# EAGLE design FinalChannel (EAGLE 8.0.0)
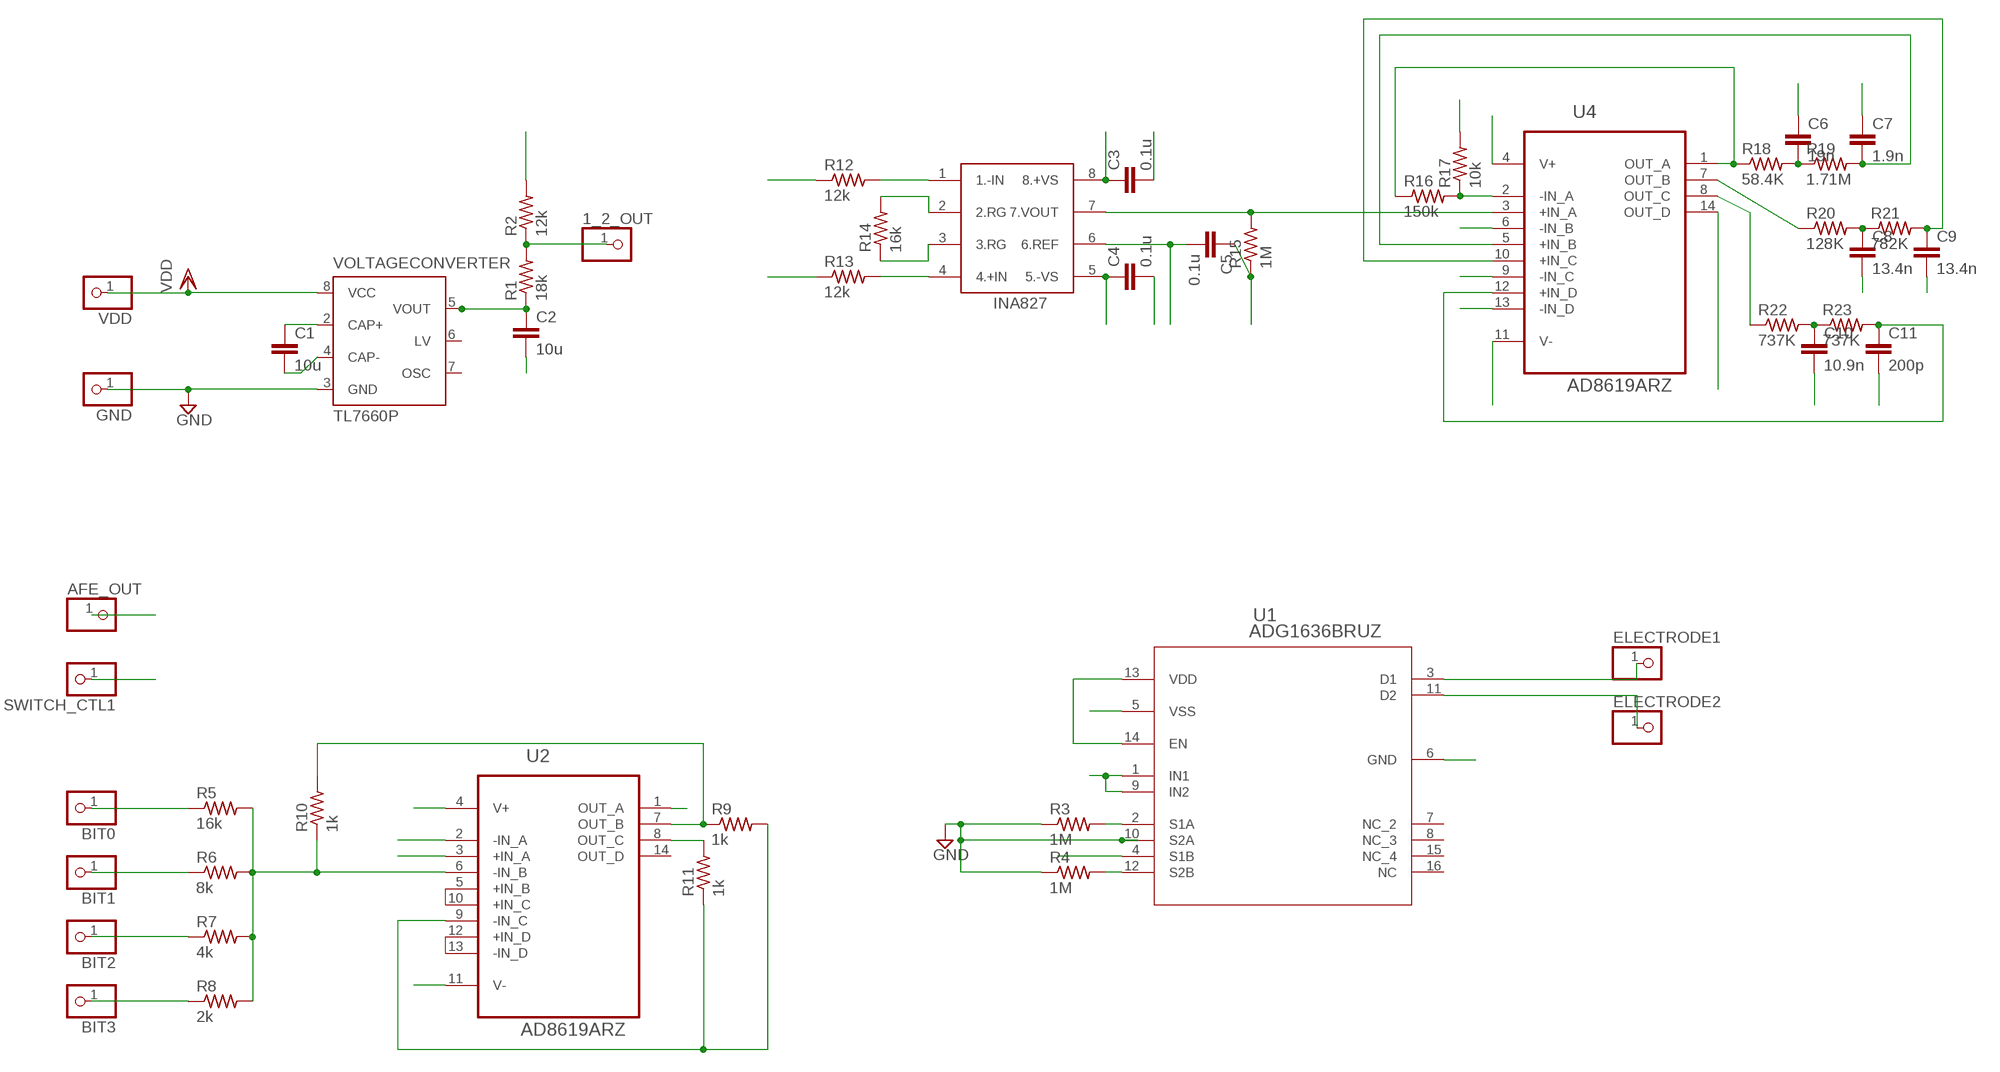
[diagram p0: schematic, sheet 1]

## Parts
1_2_OUT  PINHD-1X1  [1X01]
AFE_OUT  PINHD-1X1  [1X01]
BIT0  PINHD-1X1  [1X01]
BIT1  PINHD-1X1  [1X01]
BIT2  PINHD-1X1  [1X01]
BIT3  PINHD-1X1  [1X01]
C1  10u  C-EUC0805  [C0805]
C2  10u  C-EUC0805  [C0805]
C3  0.1u  C-EUC0805  [C0805]
C4  0.1u  C-EUC0805  [C0805]
C5  0.1u  C-EUC0805  [C0805]
C6  19n  C-EUC0805  [C0805]
C7  1.9n  C-EUC0805  [C0805]
C8  13.4n  C-EUC0805  [C0805]
C9  13.4n  C-EUC0805  [C0805]
C10  10.9n  C-EUC0805  [C0805]
C11  200p  C-EUC0805  [C0805]
ELECTRODE1  PINHD-1X1  [1X01]
ELECTRODE2  PINHD-1X1  [1X01]
GND  PINHD-1X1  [1X01]
INA1  INA827  [INA827]
R1  18k  R-US_R0805  [R0805]
R2  12k  R-US_R0805  [R0805]
R3  1M  R-US_M0805  [M0805]
R4  1M  R-US_M0805  [M0805]
R5  16k  R-US_M0805  [M0805]
R6  8k  R-US_M0805  [M0805]
R7  4k  R-US_M0805  [M0805]
R8  2k  R-US_M0805  [M0805]
R9  1k  R-US_M0805  [M0805]
R10  1k  R-US_M0805  [M0805]
R11  1k  R-US_M0805  [M0805]
R12  12k  R-US_M0805  [M0805]
R13  12k  R-US_M0805  [M0805]
R14  16k  R-US_M0805  [M0805]
R15  1M  R-US_M0805  [M0805]
R16  150k  R-US_M0805  [M0805]
R17  10k  R-US_M0805  [M0805]
R18  58.4K  R-US_M0805  [M0805]
R19  1.71M  R-US_M0805  [M0805]
R20  128K  R-US_M0805  [M0805]
R21  782K  R-US_M0805  [M0805]
R22  737K  R-US_M0805  [M0805]
R23  737K  R-US_M0805  [M0805]
SWITCH_CTL1  PINHD-1X1  [1X01]
U1  ADG1636BRUZ  [RU_16]
U2  AD8619ARZ  [SOIC127P600X175-14N]
U4  AD8619ARZ  [SOIC127P600X175-14N]
VDD  PINHD-1X1  [1X01]
VOLTAGECONVERTER  TL7660P  [DIL08]

## Nets
1_2_OUT: 1_2_OUT.1 R1.2 R2.1
AFE_OUT: AFE_OUT.1 C10.2 U4.13(-IN_D) U4.14(OUT_D)
CTL1: SWITCH_CTL1.1 U1.1(IN1) U1.9(IN2)
E_1: ELECTRODE1.1 U1.3(D1)
E_2: ELECTRODE2.1 U1.11(D2)
GND: C2.2 C3.2 C4.2 C7.1 C9.2 C11.2 GND.1 R2.2 R3.1 R4.1 R17.2 U1.6(GND) U1.10(S2A) U2.3(+IN_A) U2.5(+IN_B) U2.10(+IN_C) U2.12(+IN_D) U2.13(-IN_D) VOLTAGECONVERTER.3(GND)
IN_N: R4.2 R12.1 U1.12(S2B)
IN_P: R3.2 R13.1 U1.2(S1A)
N$1: C1.1 VOLTAGECONVERTER.2(CAP+)
N$2: C1.2 VOLTAGECONVERTER.4(CAP-)
N$3: R9.2 R11.1 U2.9(-IN_C)
N$4: INA1.1(1.-IN) R12.2
N$5: INA1.4(4.+IN) R13.2
N$6: BIT0.1 R5.1
N$7: BIT1.1 R6.1
N$10: BIT2.1 R7.1
N$11: BIT3.1 R8.1
N$12: R5.2 R6.2 R7.2 R8.2 R10.1 U2.6(-IN_B)
N$13: R9.1 R10.2 U2.7(OUT_B)
N$14: INA1.2(2.RG) R14.2
N$15: INA1.3(3.RG) R14.1
N$17: INA1.7(7.VOUT) R15.2 U4.3(+IN_A)
N$19: R16.2 R17.1 U4.2(-IN_A)
N$20: R16.1 R18.1 U4.1(OUT_A)
N$21: C6.2 R18.2 R19.1
N$22: C7.2 R19.2 U4.5(+IN_B)
N$23: C8.1 R20.2 R21.1
N$24: C9.1 R21.2 U4.10(+IN_C)
N$25: C10.1 R22.2 R23.1
N$26: C11.1 R23.2 U4.12(+IN_D)
OUT_B: C6.1 R20.1 U4.6(-IN_B) U4.7(OUT_B)
OUT_C: C8.2 R22.1 U4.8(OUT_C) U4.9(-IN_C)
P_GEN_OUT: R11.2 U1.4(S1B) U2.8(OUT_C)
SINGLE-: C5.1 R15.1 U2.2(-IN_A)
SINGLE_OUT: C5.2 INA1.6(6.REF) U2.1(OUT_A)
VDD: C3.1 INA1.8(8.+VS) U1.13(VDD) U1.14(EN) U2.4(V+) U4.4(V+) VDD.1 VOLTAGECONVERTER.8(VCC)
VDD-: C2.1 C4.1 INA1.5(5.-VS) R1.1 U1.5(VSS) U2.11(V-) U4.11(V-) VOLTAGECONVERTER.5(VOUT)
Unconnected: U1.7(NC_2) U1.8(NC_3) U1.15(NC_4) U1.16(NC) U2.14(OUT_D) VOLTAGECONVERTER.6(LV) VOLTAGECONVERTER.7(OSC)

## Library data of the parts
1_2_OUT AFE_OUT BIT0 BIT1-BIT3 ELECTRODE1 ELECTRODE2 GND SWITCH_CTL1 VDD = pinhead:PINHD-1X1: PIN HEADER
C1-C11 = rcl:C-EU: CAPACITOR, European symbol
INA1 = INA827:INA827
R1-R23 = rcl:R-US_: RESISTOR, American symbol
U1 = ADParts:ADG1636BRUZ
U2 U4 = AD8619ARZ:AD8619ARZ: Operational Amplifiers; AVAILABILITY: Good; DESCRIPTION: OP Amp Quad GP R-R I/O ???}2.5V/5V 14-Pin SOIC N Tube; MF: Analog Devices; MP: AD8619ARZ; PACKAGE: SOIC-14 Analog Devices; PRICE: 1.96 USD
VOLTAGECONVERTER = texas:TL7660: CMOS VOLTAGE CONVERTER Source: http://focus.ti.com/lit/ds/scas794/scas794.pdf; MPN: TL7660CP; OC_FARNELL: 1755283; OC_NEWARK: 14M2447

## Board
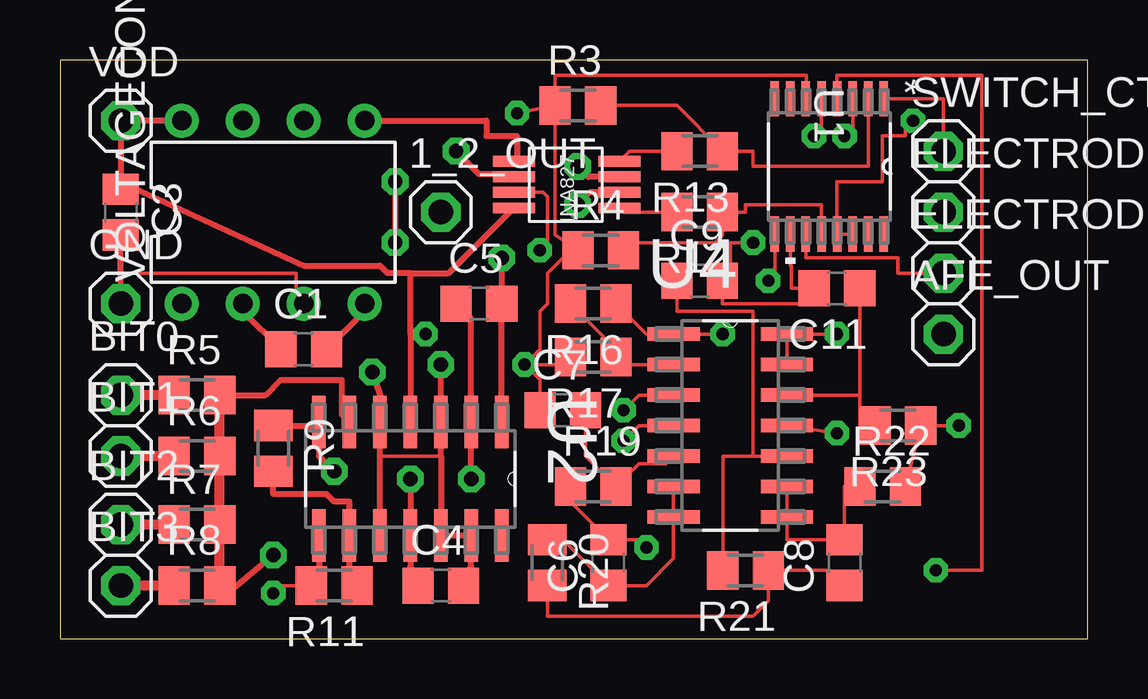
[diagram p1: board, top side]
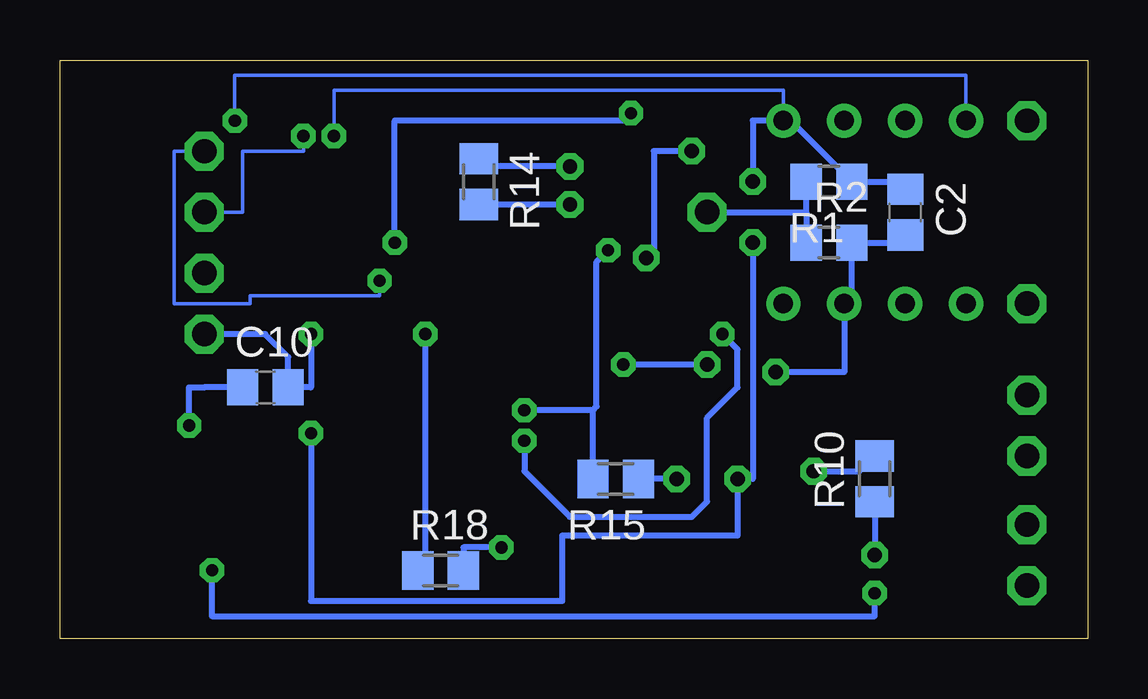
[diagram p2: board, bottom side, seen from below]

Size 42.85 x 24.12 mm. Coordinates in mm from the lower left corner, seen from the top.
Outline: 0,0 42.85,0 42.85,24.12 0,24.12 0,0
Copper layers (1*16): Top 0.035mm / dielectric 1.5mm / Bottom 0.035mm
Design rules "AdvancedCircuitsBarebones": minimum track width 6mil, minimum drill 20mil, track to track 6mil, track to pad 6mil, pad to pad 6mil, via to via 6mil, smd to smd 6mil, copper to edge 10mil, drill to drill 6mil, minimum pad ring 12mil, minimum via ring 10mil, stop-mask expansion 4mil, vias tented up to drill 25mil, thermal gap 10mil

### Footprints (pad centres in the part's own frame; a part is rotated, then mirrored left to right if it is on the bottom)
1X01 = drill 1.016 octagon: 1 0,0
C0805 = smd 1.3 x 1.5: 1 -0.95,0; 2 0.95,0
INA827 = smd 1.75 x 0.45: 1 -3,3; 2 -3,2.35; 3 -3,1.7; 4 -3,1.05; 5 1.4,1.05; 6 1.4,1.7; 7 1.4,2.35; 8 1.4,3
R0805 = smd 1.3 x 1.5: 1 -0.95,0; 2 0.95,0
M0805 = smd 1.3 x 1.6: 1 -0.95,0; 2 0.95,0
RU_16 = smd 1.473 x 0.356: 1 -2.819,2.275; 2 -2.819,1.625; 3 -2.819,0.975; 4 -2.819,0.325; 5 -2.819,-0.325; 6 -2.819,-0.975; 7 -2.819,-1.625; 8 -2.819,-2.275; 9 2.819,-2.275; 10 2.819,-1.625; 11 2.819,-0.975; 12 2.819,-0.325; 13 2.819,0.325; 14 2.819,0.975; 15 2.819,1.625; 16 2.819,2.275
SOIC127P600X175-14N = smd 2.184 x 0.559: 1 -2.362,3.81; 2 -2.362,2.54; 3 -2.362,1.27; 4 -2.362,0; 5 -2.362,-1.27; 6 -2.362,-2.54; 7 -2.362,-3.81; 8 2.362,-3.81; 9 2.362,-2.54; 10 2.362,-1.27; 11 2.362,0; 12 2.362,1.27; 13 2.362,2.54; 14 2.362,3.81
DIL08 = drill 0.813 pad 1.27: 1 -3.81,-3.81; 2 -1.27,-3.81; 3 1.27,-3.81; 4 3.81,-3.81; 5 3.81,3.81; 6 1.27,3.81; 7 -1.27,3.81; 8 -3.81,3.81

### Placement (x,y rotation side)
1_2_OUT  15.88,17.78 0 top
AFE_OUT  36.83,12.7 0 top
BIT0  2.54,10.16 0 top
BIT1  2.54,7.62 0 top
BIT2  2.54,4.76 0 top
BIT3  2.54,2.22 0 top
C1  10.16,12.06 0 top
C2  7.62,17.78 270 bottom
C3  2.54,17.78 270 top
C4  15.88,2.22 0 top
C5  17.46,13.97 0 top
C6  22.86,3.17 90 top
C7  20.95,9.52 0 top
C8  32.7,3.17 90 top
C9  26.67,14.92 0 top
C10  34.29,10.48 0 bottom
C11  32.38,14.6 180 top
ELECTRODE1  36.83,17.78 0 top
ELECTRODE2  36.83,15.24 0 top
GND  2.54,13.97 0 top
INA1  20.32,20.95 180 top
R1  10.79,19.05 180 bottom
R2  10.79,16.51 0 bottom
R3  21.59,22.23 0 top
R4  22.54,16.19 0 top
R5  5.71,10.16 0 top
R6  5.71,7.62 0 top
R7  5.71,4.76 0 top
R8  5.71,2.22 0 top
R9  8.89,7.94 270 top
R10  8.89,6.67 90 bottom
R11  11.43,2.22 180 top
R12  26.67,17.78 180 top
R13  26.67,20.32 180 top
R14  25.4,19.05 270 bottom
R15  19.68,6.67 180 bottom
R16  22.23,13.97 180 top
R17  22.23,11.75 180 top
R18  26.99,2.86 0 bottom
R19  22.23,6.35 0 top
R20  20.32,3.17 270 top
R21  28.57,2.86 180 top
R22  34.29,6.35 0 top
R23  34.92,8.89 180 top
SWITCH_CTL1  36.83,20.32 0 top
U1  32.07,19.68 270 top
U2  14.61,6.67 270 top
U4  27.94,8.89 0 top
VDD  2.54,21.59 0 top
VOLTAGECONVERTER  8.89,17.78 0 top

### Tracks (layer width: path | path; a pad name or v marks a point on that pad's centre or on a via)
1_2_OUT
  Bottom 0.254: 11.74,17.78 R1.2 | 11.74,17.78 R2.1 | 1_2_OUT.1 11.74,17.78
AFE_OUT  (via drill 0.51)
  Top 0.152: U4.13 U4.14 v32.38,12.7
  Bottom 0.254: v32.38,12.7 32.38,10.48 C10.2 33.34,11.75 34.29,12.7 AFE_OUT.1
CTL1  (via drill 0.51)
  Top 0.152: U1.1 36.83,22.5 SWITCH_CTL1.1 | U1.9 29.79,14.92 v29.53,14.92
  Bottom 0.152: v29.53,14.92 29.53,14.29 34.92,14.29 34.92,13.97 38.1,13.97 38.1,20.32 SWITCH_CTL1.1
E_1  (via drill 0.51)
  Top 0.152: U1.3 33.04,20.95 v32.7,20.95
  Bottom 0.152: v32.7,20.95 32.7,20.32 35.24,20.32 35.24,17.78 ELECTRODE1.1
E_2
  Top 0.152: U1.11 31.09,16.51 | 31.09,16.51 31.09,15.87 | 31.09,15.87 31.11,15.87 | 31.09,16.51 31.09,15.87 | ELECTRODE2.1 34.92,15.24 34.92,15.87 31.09,15.87
GND  (via drill 0.51, 0.6)
  Top 0.152: R3.1 20.64,21.59 20.64,21.27 20.64,16.83 R4.1 21.27,16.19 20.32,15.24 20.32,13.97 20,13.65 20,12.06 v19.37,11.43 | v19.37,11.43 20.96,11.43 R17.2 | 30.44,16.16 U1.10 | R3.1 20.64,23.49 31.11,23.49 31.11,22.53 U1.6 | 30.48,16.9 U1.10 | C7.1 20,10.79 v19.37,11.43 | v28.89,16.51 27.94,16.51 27.94,14.92 C9.2 27.62,13.97 31.11,13.97 31.11,14.6 C11.2 30.48,14.6 30.48,15.56 30.44,15.56 U1.10 | v19.05,21.91 R3.1 | U2.5 13.34,7.62 15.88,7.62 | C3.2 2.54,15.24 9.85,15.24 9.85,13.97 VOLTAGECONVERTER.3
  Top 0.254: U2.10 U2.5 13.34,10.16 v13.02,11.11 | GND.1 C3.2 | C4.2 17.14,3.03 U2.13 U2.12 15.88,7.62 U2.3 v15.88,11.43
  Bottom 0.254: C2.2 7.94,16.51 R2.2 9.85,14.29 VOLTAGECONVERTER.3 10.16,11.11 v13.02,11.11 | v28.89,16.51 28.89,21.59 19.05,21.59 v19.05,21.91 | v15.88,11.43 v19.37,11.43
IN_N
  Top 0.152: R4.2 23.81,16.51 27.3,16.51 27.62,16.82 R12.1 28.57,17.78 28.57,18.1 31.74,18.1 | 31.74,18.1 31.74,17.78 | 31.74,17.78 U1.12 | 31.74,17.78 31.74,18.1
IN_P
  Top 0.152: R3.2 25.71,22.23 R13.1 28.89,20.32 28.89,19.68 33.69,19.68 U1.2
  Top 0.254: R3.2 22.54,21.59 22.86,21.59
N$1
  Top 0.254: VOLTAGECONVERTER.2 7.62,13.65 C1.1
N$2
  Top 0.254: VOLTAGECONVERTER.4 12.7,13.65 C1.2
N$3
  Top 0.254: R11.1 12.06,2.22 U2.9 12.06,5.71 11.43,5.71 11.11,6.03 8.89,6.03 R9.2
N$4
  Top 0.152: R12.2 23.5,17.78 INA1.1
N$5
  Top 0.152: R13.2 23.73,20.32 INA1.4
N$6
  Top 0.406: R5.1 BIT0.1
N$7
  Top 0.406: R6.1 BIT1.1
N$10
  Top 0.406: R7.1 BIT2.1
N$11
  Top 0.406: R8.1 BIT3.1
N$12  (via drill 0.6)
  Top 0.254: R5.2 8.57,10.16 9.21,10.79 11.75,10.79 11.75,9.35 U2.6 | v8.89,3.49 6.98,1.9 R8.2
  Top 0.406: R5.2 R6.2 R7.2 R8.2
  Bottom 0.254: R10.1 v8.89,3.49
N$13  (via drill 0.6)
  Top 0.254: R9.1 10.65,8.89 U2.7 10.79,7.62 v11.43,6.98
  Bottom 0.254: v11.43,6.98 9.52,6.98 R10.2
N$14  (via drill 0.6)
  Top 0.254: INA1.2 22.1,18.6 v21.59,18.1
  Bottom 0.254: v21.59,18.1 R14.2
N$15  (via drill 0.6)
  Top 0.254: INA1.3 22.02,19.26 v21.59,19.68
  Bottom 0.254: v21.59,19.68 25.09,19.68 R14.1
N$17  (via drill 0.51)
  Top 0.152: INA1.7 20.13,18.6 20.32,18.41 20.32,16.51 v20,16.19 | U4.3 24.13,10.16 v23.5,9.52
  Bottom 0.254: R15.2 20.64,9.52 | 20.64,9.52 v23.5,9.52 | 20.64,9.52 20.48,9.68 20.48,15.72 v20,16.19
N$19
  Top 0.152: U4.2 23.49,11.43 R17.1 23.18,12.07 R16.2
N$20  (via drill 0.51)
  Top 0.152: R16.1 24.45,12.7 U4.1 v27.62,12.7
  Bottom 0.254: v27.62,12.7 27.62,3.17 R18.1
N$21  (via drill 0.51)
  Top 0.152: R19.1 21.27,5.71 C6.2 24.13,4.12 v24.45,3.81
  Bottom 0.254: v24.45,3.81 26.04,3.81 R18.2
N$22
  Top 0.152: C7.2 21.91,7.62 R19.2 24.13,7.3 25.26,7.3 U4.5
N$23
  Top 0.152: C8.1 32.07,2.86 R21.1 29.53,1.59 28.89,0.95 20.32,0.95 R20.2
N$24
  Top 0.152: R21.2 27.62,7.62 28.89,7.62 | 28.89,7.62 U4.10 | 28.89,7.62 28.89,13.65 25.72,13.65 C9.1
N$25  (via drill 0.51)
  Top 0.152: R22.2 R23.1 v37.47,8.89
  Bottom 0.152: 36.83,10.48 C10.1
  Bottom 0.254: v37.47,8.89 37.47,10.48 36.83,10.48 C10.1
N$26
  Top 0.152: R23.2 33.34,8.89 33.34,10.16 | 33.34,10.16 C11.1 | U4.12 33.34,10.16
OUT_B
  Top 0.152: U4.6 U4.7 25.58,3.35 24.45,2.22 C6.1 20.96,4.12 R20.1
OUT_C
  Top 0.152: U4.9 U4.8 30.3,4.12 C8.2 32.7,6.35 R22.1
P_GEN_OUT  (via drill 0.51)
  Top 0.152: U1.4 32.39,23.49 | 32.39,23.49 32.38,23.49 | 32.39,23.49 38.42,23.49 38.42,2.86 v36.51,2.86 | v8.89,1.9 8.89,2.22 R11.2
  Top 0.254: U2.8 10.79,2.22 R11.2
  Bottom 0.254: v36.51,2.86 36.51,0.95 8.89,0.95 v8.89,1.9
SINGLE-  (via drill 0.6)
  Top 0.254: v17.14,6.67 U2.2 17.14,13.34 C5.1
  Bottom 0.254: v17.14,6.67 R15.1
SINGLE_OUT  (via drill 0.6)
  Top 0.254: U2.1 C5.2 v18.41,15.87 | INA1.6 18.92,19.37 17.46,19.37 v16.51,20.32
  Bottom 0.254: v18.41,15.87 18.1,16.19 18.1,20.32 v16.51,20.32
VDD  (via drill 0.51)
  Top 0.152: U1.14 U1.13 32.39,19.05 34.29,19.05 34.29,20.95 35.24,20.95 35.24,21.59 v35.56,21.59 | U4.4 24.13,8.89 v23.5,8.26 | v15.24,12.7 14.61,12.7
  Top 0.254: VOLTAGECONVERTER.8 VDD.1 C3.1 3.18,18.73 10.16,15.56 13.34,15.56 13.65,15.24 14.61,15.24 | INA1.8 16.2,15.24 14.61,15.24 | U2.4 14.61,12.7 14.61,15.24
  Bottom 0.152: v35.56,21.59 35.56,23.49 5.08,23.49 VOLTAGECONVERTER.8
  Bottom 0.254: v23.5,8.26 23.5,6.98 21.59,5.08 16.51,5.08 15.88,5.71 15.88,9.21 14.61,10.48 14.61,12.06 v15.24,12.7
VDD-  (via drill 0.51, 0.6)
  Top 0.152: U1.5 31.74,20.95 v31.43,20.95 | U4.11 v32.38,8.57
  Top 0.254: C4.1 14.61,3.03 U2.11 v14.61,6.67 | v13.97,19.05 v13.97,16.51 | VOLTAGECONVERTER.5 17.78,21.59 17.78,20.95 19.05,20.95 19.05,19.9 INA1.5
  Bottom 0.152: VOLTAGECONVERTER.5 12.7,22.86 31.43,22.86 v31.43,20.95
  Bottom 0.254: C2.1 7.94,19.05 R1.1 12.38,21.59 VOLTAGECONVERTER.5 13.97,21.59 v13.97,19.05 | v13.97,16.51 13.97,6.67 v14.61,6.67 U2.11 21.91,4.3 21.91,1.59 32.38,1.59 v32.38,8.57